# EAGLE design power-supply (EAGLE 7.7.0)
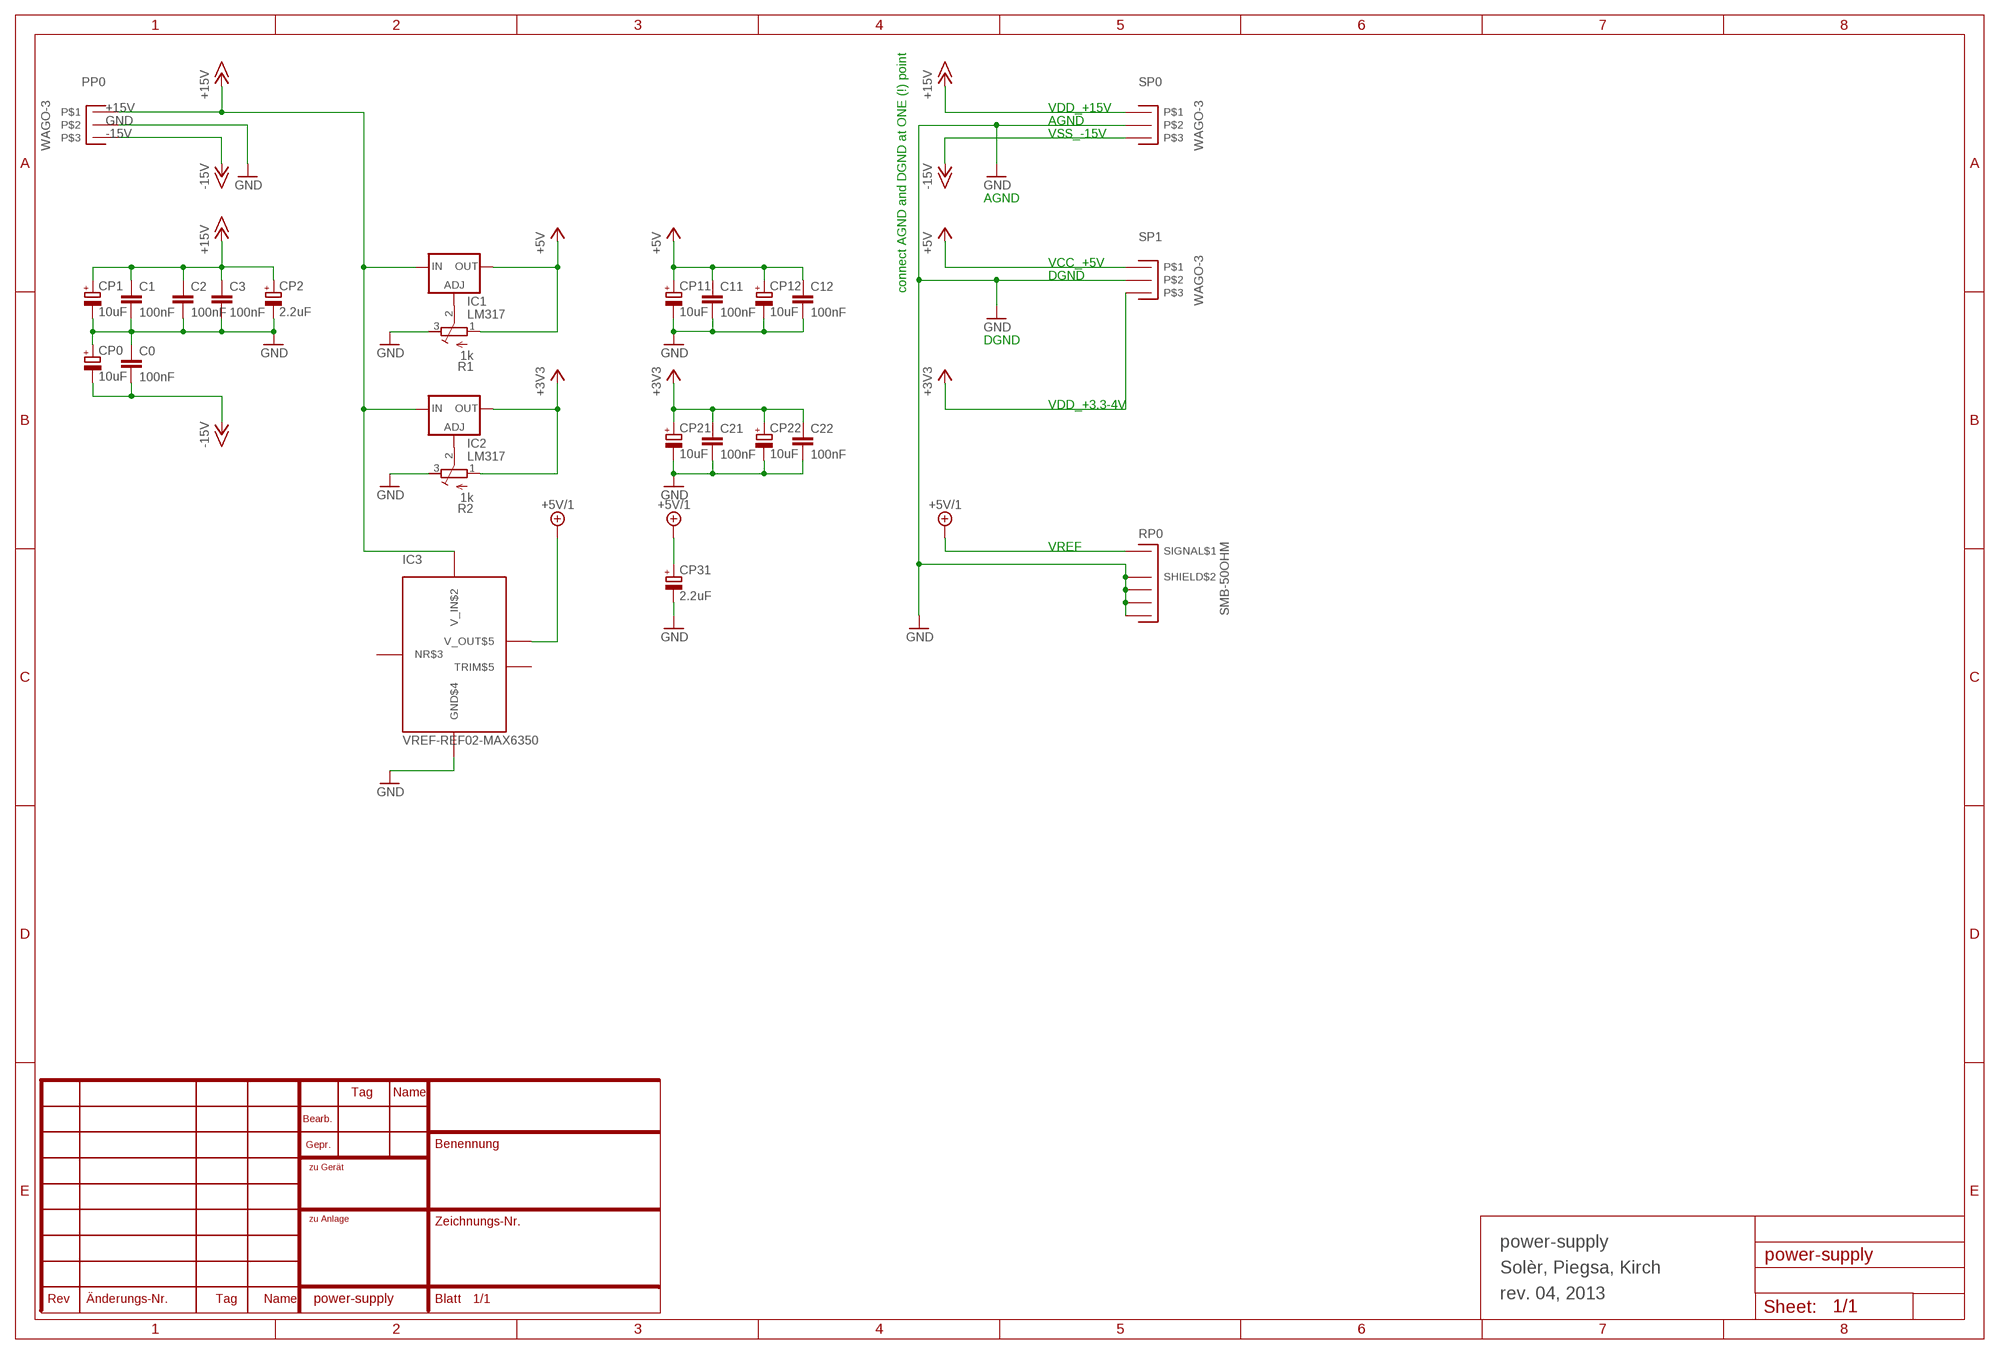
[diagram p0: schematic, sheet 1]

## Parts
C0  100nF  C-EU050-025X075  [C050-025X075]
C1  100nF  C-EU050-025X075  [C050-025X075]
C2  100nF  C-EU050-025X075  [C050-025X075]
C3  100nF  C-EU050-025X075  [C050-025X075]
C11  100nF  C-EU050-025X075  [C050-025X075]
C12  100nF  C-EU050-025X075  [C050-025X075]
C21  100nF  C-EU050-025X075  [C050-025X075]
C22  100nF  C-EU050-025X075  [C050-025X075]
CP0  10uF  CPOL-EUB45181B  [B45181B]
CP1  10uF  CPOL-EUB45181B  [B45181B]
CP2  2.2uF  CPOL-EUB45181B  [B45181B]
CP11  10uF  CPOL-EUB45181B  [B45181B]
CP12  10uF  CPOL-EUB45181B  [B45181B]
CP21  10uF  CPOL-EUB45181B  [B45181B]
CP22  10uF  CPOL-EUB45181B  [B45181B]
CP31  2.2uF  CPOL-EUB45181B  [B45181B]
IC1  LM317  LM317TS  [317TS]
IC2  LM317  LM317TS  [317TS]
IC3  VREF-REF02-MAX6350  [PDIP-8]
PP0  WAGO-3  [WAGO-3]
R1  1k  R-TRIMM3296Y  [RTRIM3296Y]
R2  1k  R-TRIMM3296Y  [RTRIM3296Y]
RP0  SMB-50OHM  [B-30]
SP0  WAGO-3  [WAGO-3]
SP1  WAGO-3  [WAGO-3]

## Nets
+3V3: C21.1 C22.1 CP21.+ CP22.+ IC2.2(OUT) R2.1(A) SP1.P$3
+5V: C11.1 C12.1 CP11.+ CP12.+ IC1.2(OUT) R1.1(A) SP1.P$1
+5V/1: CP31.+ IC3.V_OUT$6(V_OUT$5) RP0.P$1(SIGNAL$1)
+15V: C1.1 C2.1 C3.1 CP1.+ CP2.+ IC1.3(IN) IC2.3(IN) IC3.V_IN$2 PP0.P$1 SP0.P$1
-15V: C0.2 CP0.- PP0.P$3 SP0.P$3
GND: C0.1 C1.2 C2.2 C3.2 C11.2 C12.2 C21.2 C22.2 CP0.+ CP1.- CP2.- CP11.- CP12.- CP21.- CP22.- CP31.- IC3.GND$4 PP0.P$2 R1.3(E) R2.3(E) RP0.P$2(SHIELD$2) RP0.P$3(SHIELD$3) RP0.P$4(SHIELD$4) RP0.P$5(SHIELD$5) SP0.P$2 SP1.P$2
N$1: IC1.1(ADJ) R1.2(S)
N$2: IC2.1(ADJ) R2.2(S)
Unconnected: IC3.NR$3 IC3.TRIM$5

## Notes on the sheet
- VDD_+15V
- AGND
- VSS_-15V
- AGND
- VCC_+5V
- DGND
- connect AGND and DGND at ONE (!) point
- DGND
- VDD_+3.3-4V
- VREF
- power-supply
- Solèr, Piegsa, Kirch
- rev. 04, 2013

## Library data of the parts
C0 C1-C3 C11 C12 C21 C22 = rcl:C-EU: CAPACITOR, European symbol
CP0 CP1 CP2 CP11 CP12 CP21 CP22 CP31 = rcl:CPOL-EU: POLARIZED CAPACITOR, European symbol
IC1 IC2 = v-reg:LM317TS: VOLTAGE REGULATOR
IC3 = parts:VREF-REF02-MAX6350
PP0 SP0 SP1 = parts:WAGO-3
R1 R2 = rcl:R-TRIMM: Trimm resistor
RP0 = parts:SMB-50OHM

## Board
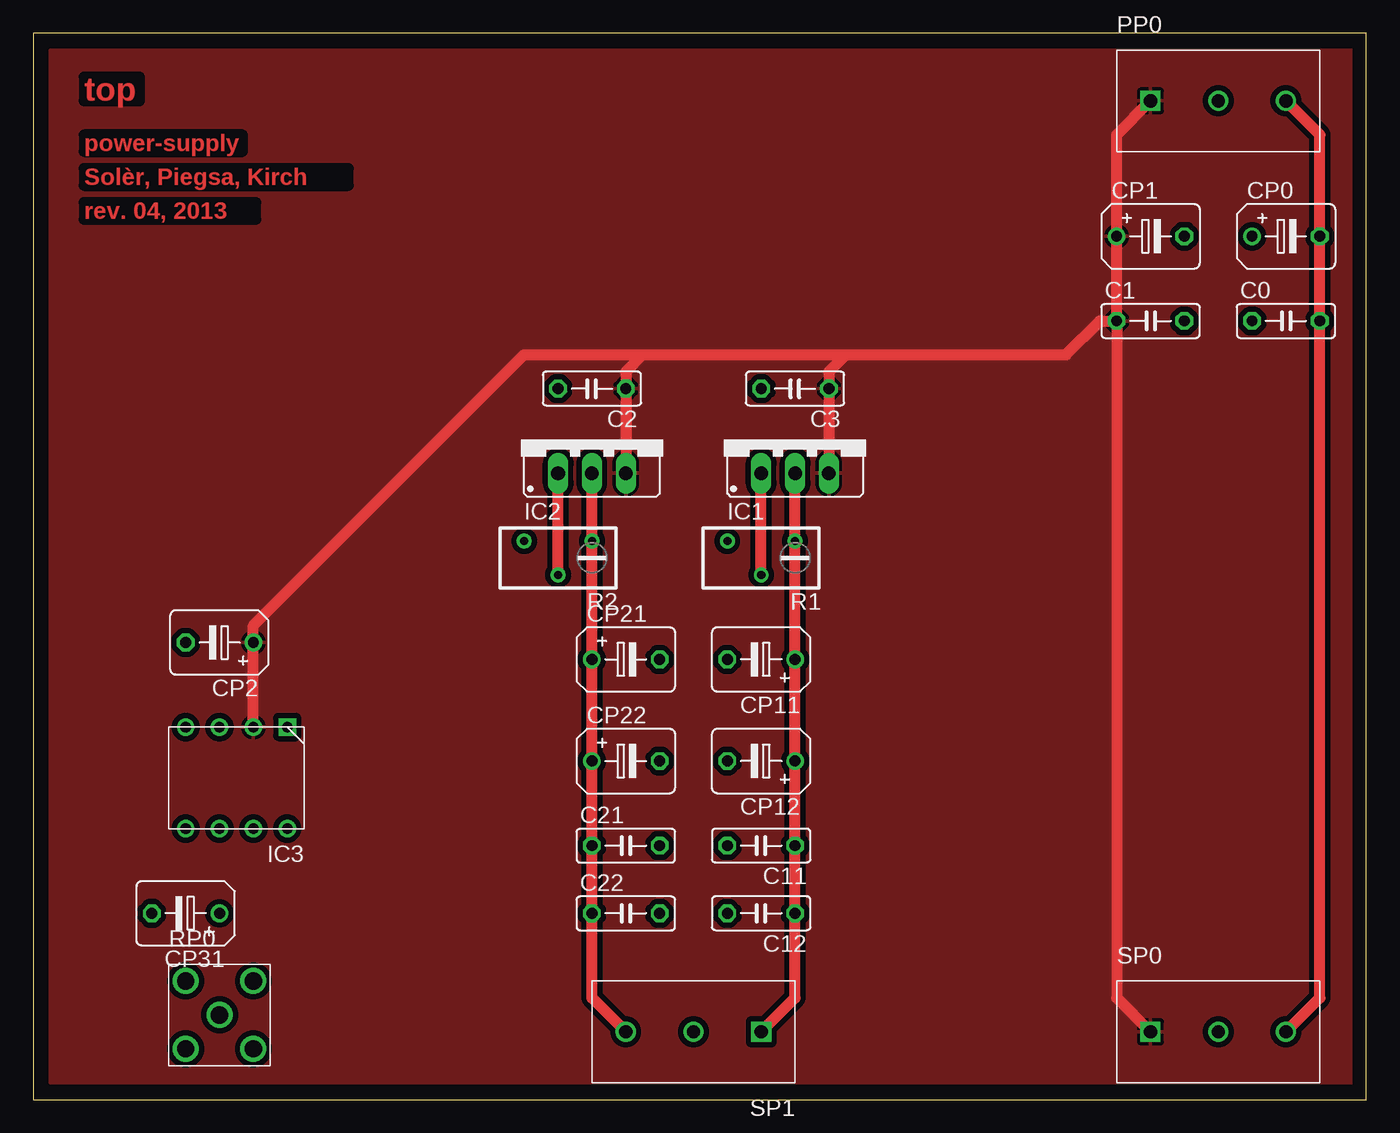
[diagram p1: board, top side]
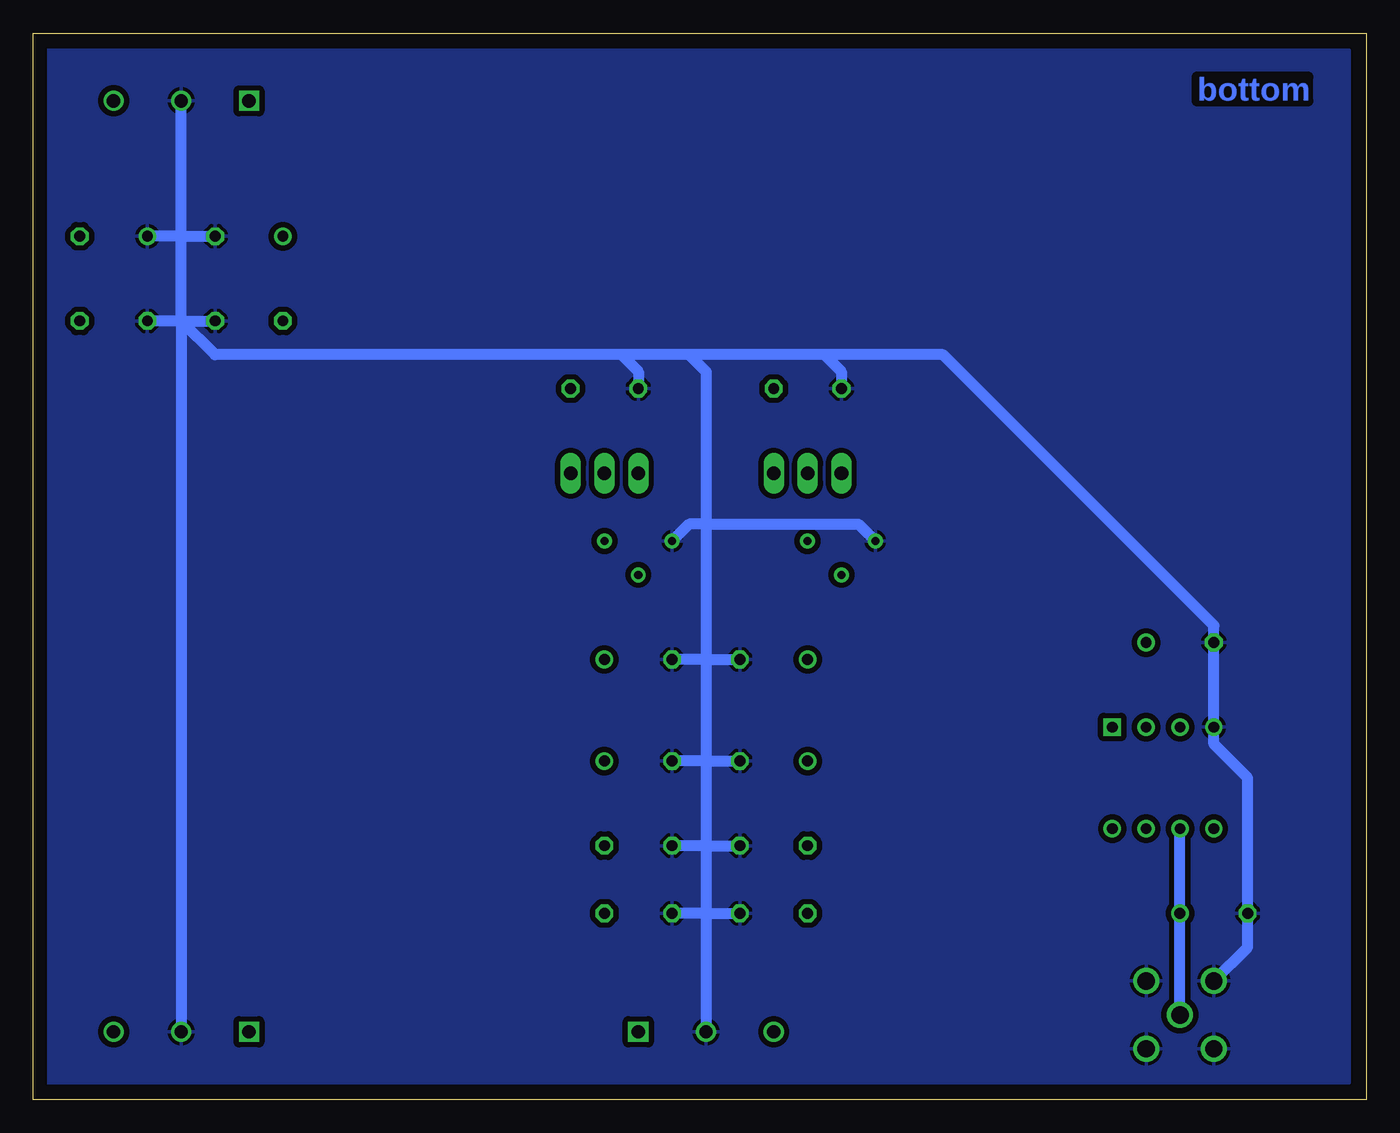
[diagram p2: board, bottom side, seen from below]

Size 100 x 80 mm. Coordinates in mm from the lower left corner, seen from the top.
Outline: 0,0 100,0 100,80 0,80 0,0
Copper layers (1*16): Top 0.035mm / dielectric 1.5mm / Bottom 0.035mm
Design rules "default": minimum track width 10mil, minimum drill 24mil, track to track 8mil, track to pad 8mil, pad to pad 8mil, via to via 8mil, smd to smd 8mil, copper to edge 40mil, drill to drill 8mil, minimum pad ring 10mil, minimum via ring 8mil, stop-mask expansion 4mil, vias tented up to drill 0mil, thermal gap 10mil

### Footprints (pad centres in the part's own frame; a part is rotated, then mirrored left to right if it is on the bottom)
C050-025X075 = drill 0.813 octagon: 1 -2.54,0; 2 2.54,0
B45181B = drill 0.813: + -2.54,0 | drill 0.813 octagon: - 2.54,0
317TS = drill 1.016 long: 1 -2.54,-2.54; 2 0,-2.54; 3 2.54,-2.54
PDIP-8 = drill 0.8: GND$4 3.81,-3.81; N.C.$7 -1.27,3.81; N.C.$8 -3.81,3.81; NR$3 1.27,-3.81; TRIM$5 3.81,3.81; V_IN$2 -1.27,-3.81; V_OUT$6 1.27,3.81 | drill 0.8 square: N.C.$1 -3.81,-3.81
WAGO-3 = drill 1 square: P$1 -5.08,0 | drill 1: P$2 0,0; P$3 5.08,0
RTRIM3296Y = drill 0.61: 1 1.27,-2.54; 2 -1.27,0; 3 1.27,2.54
B-30 = drill 1.3: P$1 0,0; P$2 -2.54,2.54; P$3 -2.54,-2.54; P$4 2.54,-2.54; P$5 2.54,2.54

### Placement (x,y rotation side)
C0  93.98,58.42 0 top
C1  83.82,58.42 0 top
C2  41.91,53.34 180 top
C3  57.15,53.34 180 top
C11  54.61,19.05 180 top
C12  54.61,13.97 180 top
C21  44.45,19.05 0 top
C22  44.45,13.97 0 top
CP0  93.98,64.77 0 top
CP1  83.82,64.77 0 top
CP2  13.97,34.29 180 top
CP11  54.61,33.02 180 top
CP12  54.61,25.4 180 top
CP21  44.45,33.02 0 top
CP22  44.45,25.4 0 top
CP31  11.43,13.97 180 top
IC1  57.15,49.53 0 top
IC2  41.91,49.53 0 top
IC3  15.24,24.13 180 top
PP0  88.9,74.93 0 top
R1  54.61,40.64 90 top
R2  39.37,40.64 90 top
RP0  13.97,6.35 0 top
SP0  88.9,5.08 0 top
SP1  49.53,5.08 180 top

### Tracks (layer width: path | path; a pad name or v marks a point on that pad's centre or on a via)
+3V3
  Top 0.813: SP1.P$3 41.91,7.62 C22.1 C21.1 CP22.+ CP21.+ R2.1 IC2.2
+5V
  Top 0.813: SP1.P$1 57.15,7.62 C12.1 C11.1 CP12.+ CP11.+ R1.1 IC1.2
+5V/1
  Bottom 0.813: IC3.V_OUT$6 CP31.+ RP0.P$1
+15V
  Top 0.813: C1.1 CP1.+ 81.28,72.39 PP0.P$1 | IC3.V_IN$2 CP2.+ 16.51,35.56 36.83,55.88 45.72,55.88 | 45.72,55.88 60.96,55.88 | C1.1 81.28,7.62 SP0.P$1 | 45.72,55.88 44.45,54.61 C2.1 IC2.3 | IC1.3 C3.1 59.69,54.61 60.96,55.88 | 60.96,55.88 77.47,55.88 80.01,58.42 C1.1
  pour Top (isolate 0.406): 1.27,78.74 99.06,78.74 99.06,1.27 1.27,1.27
-15V
  Top 0.813: PP0.P$3 96.52,72.39 CP0.- C0.2 96.52,7.62 SP0.P$3
GND
  Bottom 0.813: 88.9,58.42 SP0.P$2 | 88.9,58.42 88.9,64.77 | 88.9,64.77 PP0.P$2 | 88.9,64.77 CP0.+ | 88.9,64.77 CP1.- | 49.53,43.18 50.8,43.18 R1.3 | R2.3 38.1,43.18 49.53,43.18 | RP0.P$2 8.89,11.43 CP31.- 8.89,24.13 11.43,26.67 IC3.GND$4 CP2.- 11.43,35.56 31.75,55.88 40.64,55.88 | 88.9,58.42 C1.2 | 88.9,58.42 C0.1 | C3.2 54.61,54.61 55.88,55.88 | 88.9,58.42 86.36,55.88 55.88,55.88 | 49.53,43.18 49.53,33.02 | 49.53,33.02 49.53,25.4 | 49.53,25.4 49.53,19.05 | 49.53,19.05 49.53,13.97 | 49.53,13.97 SP1.P$2 | 49.53,33.02 CP11.- | 49.53,33.02 CP21.- | 49.53,25.4 CP22.- | 49.53,25.4 CP12.- | 49.53,19.05 C11.2 | 49.53,19.05 C21.2 | 49.53,13.97 C12.2 | 49.53,13.97 C22.2 | 49.53,43.18 49.53,54.61 50.8,55.88 | 50.8,55.88 55.88,55.88 | C2.2 39.37,54.61 40.64,55.88 | 40.64,55.88 50.8,55.88
  pour Bottom (isolate 0.406): 1.27,78.74 99.06,78.74 99.06,1.27 1.27,1.27
N$1
  Top 0.813: R1.2 IC1.1
N$2
  Top 0.813: R2.2 IC2.1

### Text on the board
Top: top | power-supply | Solèr, Piegsa, Kirch | rev. 04, 2013
Bottom: bottom